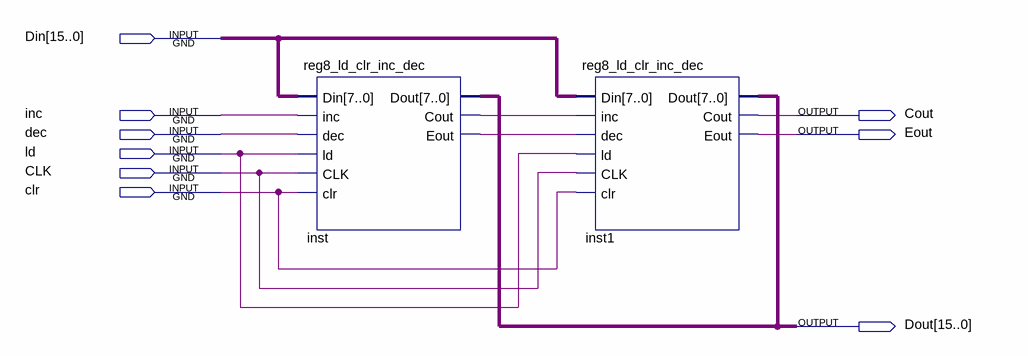
[diagram p0: schematic sheet]
// Quartus schematic reg16_ld_clr_inc_dec.bdf as structural Verilog: 2 symbols, 9 pins
module reg16_ld_clr_inc_dec (
  input  [15:0] Din,
  input  inc,
  input  dec,
  input  ld,
  input  CLK,
  input  clr,
  output Cout,
  output Eout,
  output [15:0] Dout
);

  wire inst_cout, inst_eout;

  reg8_ld_clr_inc_dec inst (
    .Din(Din[7:0]), .inc(inc), .dec(dec), .ld(ld), .CLK(CLK), .clr(clr), .Cout(inst_cout), .Eout(inst_eout),
    .Dout(Dout[7:0]));
  reg8_ld_clr_inc_dec inst1 (
    .Din(Din[15:8]), .inc(inst_cout), .dec(inst_eout), .ld(ld), .CLK(CLK), .clr(clr), .Cout(Cout),
    .Eout(Eout), .Dout(Dout[15:8]));
endmodule
